# Altium schematic sheet modFOC-Main.SchDoc: modFOC-Top
size A4; Author: Mathias Giller; CompanyName: HTL St. Pölten; Address1: modFOC; DocumentNumber: 0; Revision: 2.0; SheetNumber: 0; SheetTotal: 6
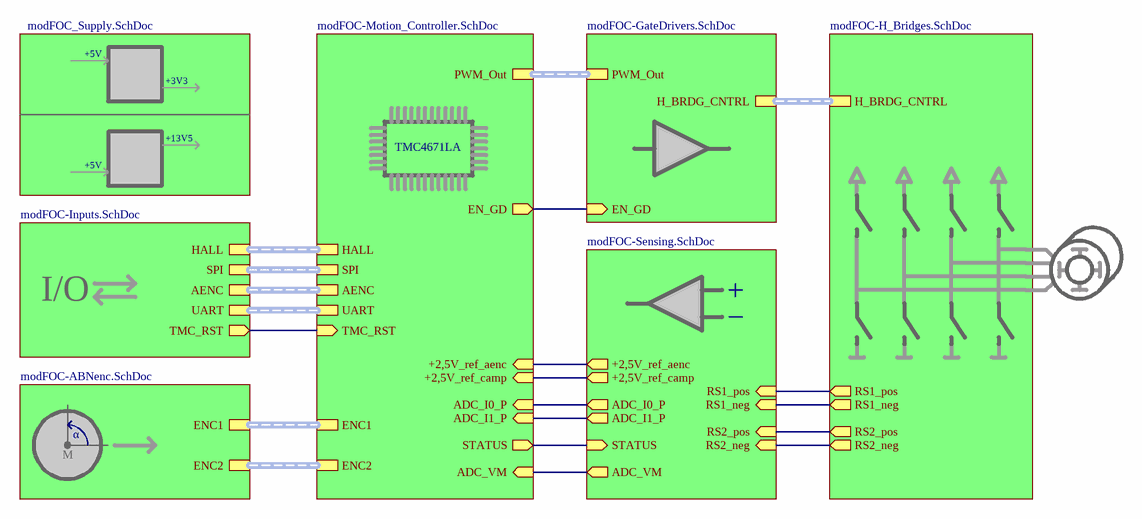
[diagram p0: modFOC-Main.SchDoc]

## Sub-sheets
ABNenc = modFOC-ABNenc.SchDoc: ENC1 (harness ENC1), ENC2 (harness ENC2)
GateDrivers = modFOC-GateDrivers.SchDoc: PWM_Out (harness PWM_Out), H_BRDG_CNTRL (harness H_BRDG_CNTRL), EN_GD (in)
H_Bridges = modFOC-H_Bridges.SchDoc: RS1_pos (out), RS1_neg (out), RS2_pos (out), RS2_neg (out), H_BRDG_CNTRL (harness H_BRDG_CNTRL)
Inputs = modFOC-Inputs.SchDoc: HALL (harness HALL), SPI (harness SPI), AENC (harness AENC), UART (harness UART), TMC_RST (out)
Motion_Controller = modFOC-Motion_Controller.SchDoc: PWM_Out (harness PWM_Out), ADC_I0_P (in), ADC_I1_P (in), STATUS (out), ADC_VM (in), SPI (harness SPI), UART (harness UART), +2,5V_ref_camp (in), HALL (harness HALL), ENC1 (harness ENC1), AENC (harness AENC), ENC2 (harness ENC2), EN_GD (out), TMC_RST (in), +2,5V_ref_aenc (in)
Sensing = modFOC-Sensing.SchDoc: ADC_I1_P (out), STATUS (in), RS2_neg (in), +2,5V_ref_camp (out), ADC_I0_P (out), RS2_pos (in), RS1_neg (in), ADC_VM (out), RS1_pos (in), +2,5V_ref_aenc (out)
Supply = modFOC_Supply.SchDoc: no entries

## Nets
(unnamed): sheet Motion_Controller/ADC_I0_P, sheet Sensing/ADC_I0_P
(unnamed): sheet Motion_Controller/ADC_I1_P, sheet Sensing/ADC_I1_P
(unnamed): sheet Motion_Controller/STATUS, sheet Sensing/STATUS
(unnamed): sheet Motion_Controller/ADC_VM, sheet Sensing/ADC_VM
(unnamed): sheet Motion_Controller/+2,5V_ref_camp, sheet Sensing/+2,5V_ref_camp
(unnamed): sheet Motion_Controller/EN_GD, sheet GateDrivers/EN_GD
(unnamed): sheet Motion_Controller/TMC_RST, sheet Inputs/TMC_RST
(unnamed): sheet Motion_Controller/+2,5V_ref_aenc, sheet Sensing/+2,5V_ref_aenc
(unnamed): sheet H_Bridges/RS1_pos, sheet Sensing/RS1_pos
(unnamed): sheet H_Bridges/RS1_neg, sheet Sensing/RS1_neg
(unnamed): sheet H_Bridges/RS2_pos, sheet Sensing/RS2_pos
(unnamed): sheet H_Bridges/RS2_neg, sheet Sensing/RS2_neg

## Buses and harness runs
harness sheet ABNenc/ENC1 = sheet Motion_Controller/ENC1
harness sheet ABNenc/ENC2 = sheet Motion_Controller/ENC2
harness sheet GateDrivers/H_BRDG_CNTRL = sheet H_Bridges/H_BRDG_CNTRL
harness sheet GateDrivers/PWM_Out = sheet Motion_Controller/PWM_Out
harness sheet Inputs/AENC = sheet Motion_Controller/AENC
harness sheet Inputs/HALL = sheet Motion_Controller/HALL
harness sheet Inputs/SPI = sheet Motion_Controller/SPI
harness sheet Inputs/UART = sheet Motion_Controller/UART

## Notes on the sheet
- +5V
- +3V3
- +13V5
- TMC4671LA
- I/O
- M
- α
- Title
- Size:
- Date:
- A4
- Number:
- Time:
- Revision:
- Sheet
- of
- File: